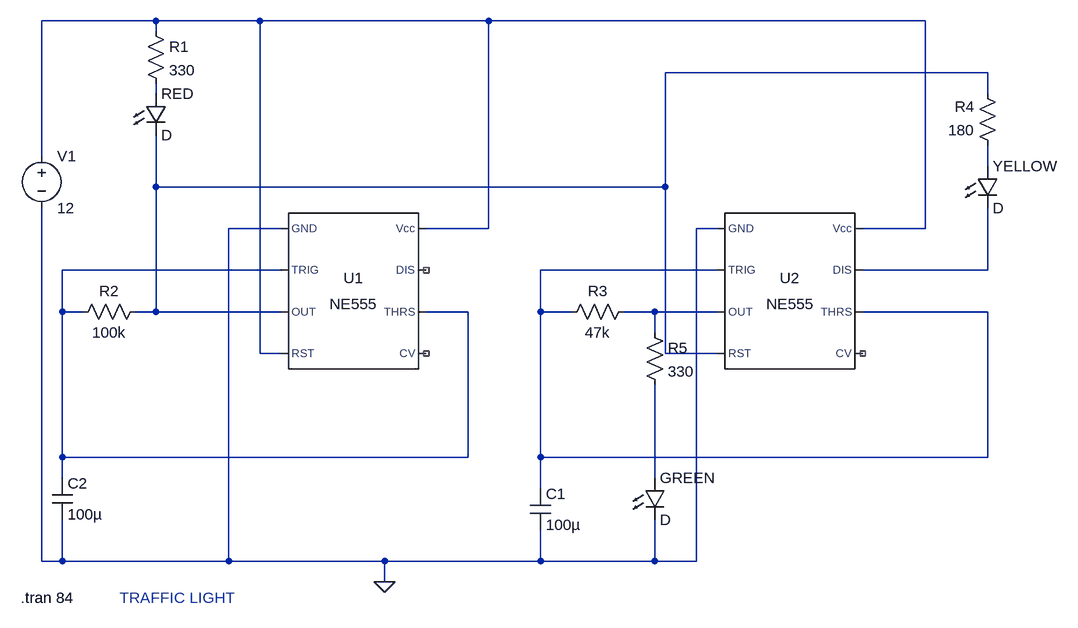
[diagram p0: schematic traffic light.asc]
traffic light.asc, the LTspice schematic file:
Version 4.1
SHEET 1 1052 680
WIRE -336 -224 -512 -224
WIRE -176 -224 -336 -224
WIRE 176 -224 -176 -224
WIRE 848 -224 176 -224
WIRE -336 -208 -336 -224
WIRE 944 -144 448 -144
WIRE -336 -112 -336 -128
WIRE 944 -112 944 -144
WIRE -512 -16 -512 -224
WIRE 944 0 944 -32
WIRE -336 32 -336 -48
WIRE 448 32 448 -144
WIRE 448 32 -336 32
WIRE -144 96 -224 96
WIRE 176 96 176 -224
WIRE 176 96 80 96
WIRE 528 96 496 96
WIRE 848 96 848 -224
WIRE 848 96 752 96
WIRE -144 160 -480 160
WIRE 528 160 256 160
WIRE 944 160 944 64
WIRE 944 160 752 160
WIRE -480 224 -480 160
WIRE -448 224 -480 224
WIRE -336 224 -336 32
WIRE -336 224 -368 224
WIRE -144 224 -336 224
WIRE 144 224 80 224
WIRE 256 224 256 160
WIRE 304 224 256 224
WIRE 432 224 384 224
WIRE 528 224 432 224
WIRE 944 224 752 224
WIRE 432 256 432 224
WIRE -176 288 -176 -224
WIRE -144 288 -176 288
WIRE 448 288 448 32
WIRE 528 288 448 288
WIRE -480 448 -480 224
WIRE 144 448 144 224
WIRE 144 448 -480 448
WIRE 256 448 256 224
WIRE 944 448 944 224
WIRE 944 448 256 448
WIRE -480 480 -480 448
WIRE 432 480 432 336
WIRE 256 496 256 448
WIRE -512 608 -512 64
WIRE -480 608 -480 544
WIRE -480 608 -512 608
WIRE -224 608 -224 96
WIRE -224 608 -480 608
WIRE 16 608 -224 608
WIRE 256 608 256 560
WIRE 256 608 16 608
WIRE 432 608 432 544
WIRE 432 608 256 608
WIRE 496 608 496 96
WIRE 496 608 432 608
WIRE 16 640 16 608
FLAG 16 640 0
SYMBOL Misc\\NE555 -32 192 R0
SYMATTR InstName U1
SYMBOL Misc\\NE555 640 192 R0
SYMATTR InstName U2
SYMBOL voltage -512 -32 R0
WINDOW 123 0 0 Left 0
WINDOW 39 0 0 Left 0
SYMATTR InstName V1
SYMATTR Value 12
SYMBOL res -352 -224 R0
SYMATTR InstName R1
SYMATTR Value 330
SYMBOL res -352 208 R90
WINDOW 0 0 56 VBottom 2
WINDOW 3 32 56 VTop 2
SYMATTR InstName R2
SYMATTR Value 100k
SYMBOL res 400 208 R90
WINDOW 0 0 56 VBottom 2
WINDOW 3 32 56 VTop 2
SYMATTR InstName R3
SYMATTR Value 47k
SYMBOL res 960 -16 R180
WINDOW 0 36 76 Left 2
WINDOW 3 36 40 Left 2
SYMATTR InstName R4
SYMATTR Value 180
SYMBOL res 416 240 R0
SYMATTR InstName R5
SYMATTR Value 330
SYMBOL cap 240 496 R0
SYMATTR InstName C1
SYMATTR Value 100µ
SYMBOL cap -496 480 R0
SYMATTR InstName C2
SYMATTR Value 100µ
SYMBOL LED -352 -112 R0
SYMATTR InstName RED
SYMBOL LED 416 480 R0
SYMATTR InstName GREEN
SYMBOL LED 928 0 R0
SYMATTR InstName YELLOW
TEXT -544 664 Left 2 !.tran 84
TEXT -392 664 Left 2 ;TRAFFIC LIGHT

The netlist it stands for:
* traffic light.asc
X§U1 0 N005 N002 N001 NC_01 N005 NC_02 N001 NE555  ; pins GND TRIG OUT RST CV THRS DIS Vcc
X§U2 0 N006 N008 N002 NC_03 N006 N007 N001 NE555  ; pins GND TRIG OUT RST CV THRS DIS Vcc
V1 N001 0 12
R1 N001 N003 330
R2 N002 N005 100k
R3 N008 N006 47k
R4 N004 N002 180
R5 N008 N009 330
C1 N006 0 100µ
C2 N005 0 100µ
D§RED N003 N002 D
D§GREEN N009 0 D
D§YELLOW N004 N007 D
.model D D
.lib standard.dio
.tran 84
* TRAFFIC LIGHT
.lib NE555.sub
.backanno
.end